# Altium schematic sheet Modules.SchDoc
size A3; Date: 27.05.2014; DrawnBy: luths8; Organization: BFH; Address1: Bern University of Applied Sciences; Address2: Engineering and Information Technology; Address3: Jlcoweg 1; Address4: CH-3400 Burgdorf; DocumentNumber: 4; Revision: 1.1; SheetNumber: 4; SheetTotal: 5; CurrentDate: 27.05.2014
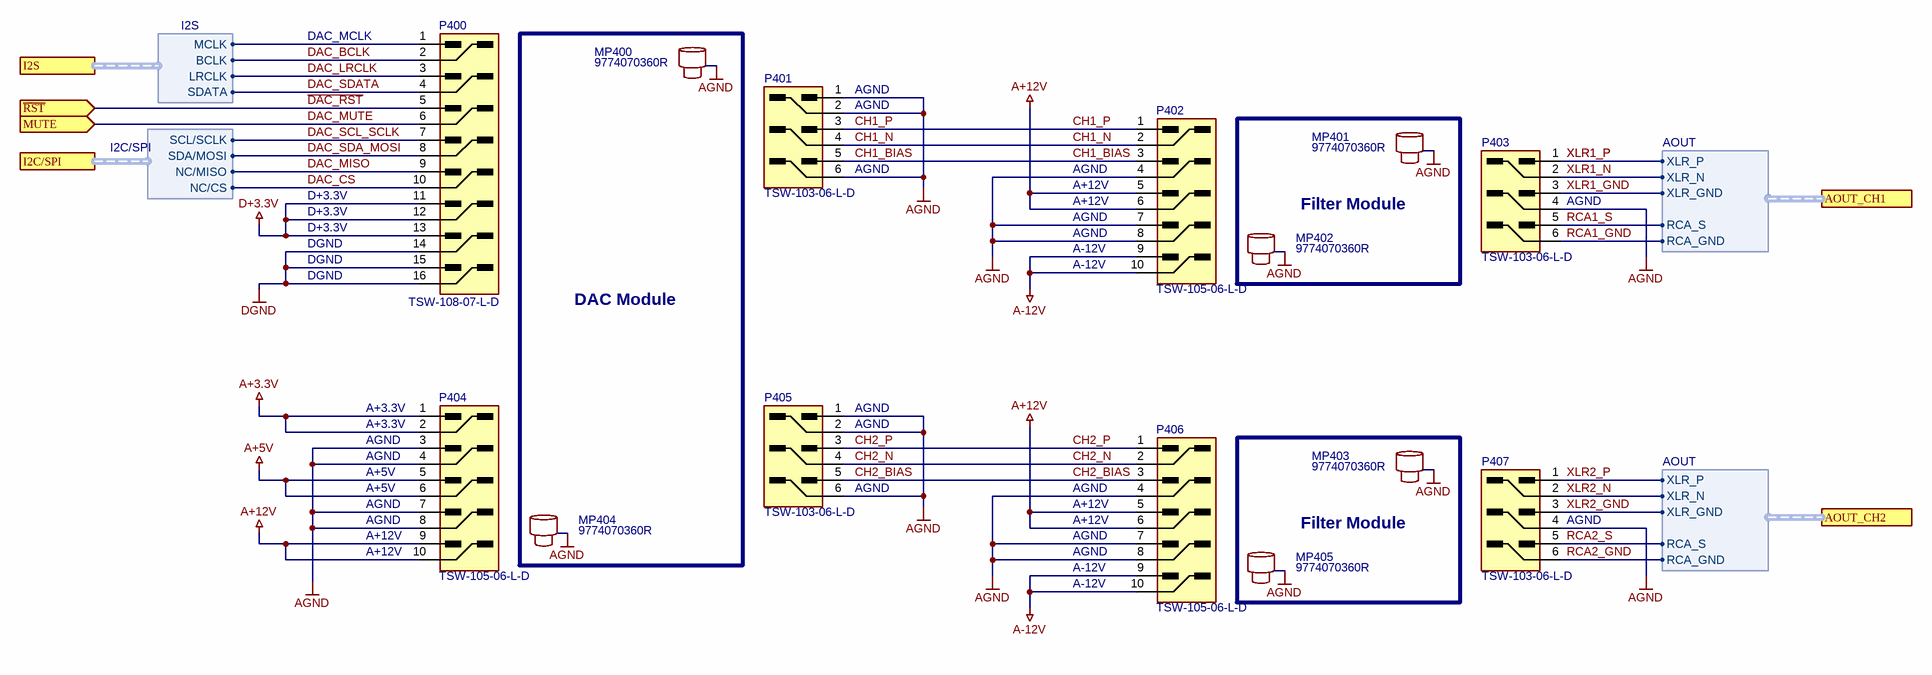
[diagram p0: Modules.SchDoc]

## Parts
MP400  9774070360R  [9774070360]
MP401  9774070360R  [9774070360]
MP402  9774070360R  [9774070360]
MP403  9774070360R  [9774070360]
MP404  9774070360R  [9774070360]
MP405  9774070360R  [9774070360]
P400  TSW-108-07-L-D  [TSW-108-06-X-D]
P401  TSW-103-06-L-D  [TSW-103-06-X-D]
P402  TSW-105-06-L-D  [TSW-105-06-X-D]
P403  TSW-103-06-L-D  [TSW-103-06-X-D]
P404  TSW-105-06-L-D  [TSW-105-06-X-D]
P405  TSW-103-06-L-D  [TSW-103-06-X-D]
P406  TSW-105-06-L-D  [TSW-105-06-X-D]
P407  TSW-103-06-L-D  [TSW-103-06-X-D]

## Blocks framed on the sheet
DAC Module: MP400 MP404
Filter Module: MP401 MP402
Filter Module: MP403 MP405

## Ports
AOUT_CH1 (harness AOUT), AOUT_CH2 (harness AOUT), I2C/SPI (harness I2C/SPI), I2S (harness I2S), MUTE (in), ~{RST} (in)

## Harnesses
I2S: MCLK, BCLK, LRCLK, SDATA
I2C/SPI: SCL/SCLK, SDA/MOSI, NC/MISO, NC/CS
AOUT: XLR_P, XLR_N, XLR_GND, RCA_S, RCA_GND

## Nets
A+3.3V: P404.1 P404.2
A+5V: P404.5 P404.6
A+12V: P402.5 P402.6 P404.9 P404.10 P406.5 P406.6
A-12V: P402.9 P402.10 P406.9 P406.10
AGND: MP400.1 MP401.1 MP402.1 MP403.1 MP404.1 MP405.1 P401.1 P401.2 P401.6 P402.4 P402.7 P402.8 P403.4 P404.3 P404.4 P404.7 P404.8 P405.1 P405.2 P405.6 P406.4 P406.7 P406.8 P407.4
D+3.3V: P400.11 P400.12 P400.13
DGND: P400.14 P400.15 P400.16
CH1_BIAS: P401.5 P402.3
CH1_N: P401.4 P402.2
CH1_P: P401.3 P402.1
CH2_BIAS: P405.5 P406.3
CH2_N: P405.4 P406.2
CH2_P: P405.3 P406.1
~{DAC_RST}: P400.5 ; port ~{RST}
DAC_BCLK: P400.2 ; port I2S.BCLK
DAC_CS: P400.10 ; port I2C/SPI.NC/CS
DAC_LRCLK: P400.3 ; port I2S.LRCLK
DAC_MISO: P400.9 ; port I2C/SPI.NC/MISO
DAC_MUTE: P400.6 ; port MUTE
DAC_SCL_SCLK: P400.7 ; port I2C/SPI.SCL/SCLK
DAC_SDA_MOSI: P400.8 ; port I2C/SPI.SDA/MOSI
DAC_SDATA: P400.4 ; port I2S.SDATA
RCA1_GND: P403.6 ; port AOUT_CH1.RCA_GND
RCA1_S: P403.5 ; port AOUT_CH1.RCA_S
RCA2_GND: P407.6 ; port AOUT_CH2.RCA_GND
RCA2_S: P407.5 ; port AOUT_CH2.RCA_S
XLR1_GND: P403.3 ; port AOUT_CH1.XLR_GND
XLR1_N: P403.2 ; port AOUT_CH1.XLR_N
XLR1_P: P403.1 ; port AOUT_CH1.XLR_P
XLR2_GND: P407.3 ; port AOUT_CH2.XLR_GND
XLR2_N: P407.2 ; port AOUT_CH2.XLR_N
XLR2_P: P407.1 ; port AOUT_CH2.XLR_P
NetP400_1: P400.1 ; port I2S.MCLK

## Notes on the sheet
- DAC_MCLK
- (near P401) AGND
- D+3.3V
- AGND
- A+12V
- (near P403) AGND
- DGND
- A-12V
- (near P404) A+3.3V
- (near P405) AGND
- (near P404) AGND
- (near P404) A+5V
- (near P404) A+12V
- (near P407) AGND
- Project:
- Size:
- Sheet:
- Title:
- A3
- of
- Drawn by:
- Revision:
- Date:
- Variant:
- b
- File:

## Library data of the parts
MP400-MP405 = Spacer M3 SMD Net: Spacer M3 SMD; Manufacturer Part No.: 9774070360R
P400 = Header 8x2P: Manufacturer Part No.: TSW-108-07-L-D
P401 P403 P405 P407 = Header 3x2P: Header 13x2P; Manufacturer Part No.: TSW-103-06-L-D
P402 P404 P406 = Header 5x2P: Manufacturer Part No.: TSW-105-06-L-D